# EasyEDA schematic hp_pcb_easyeda_std.json
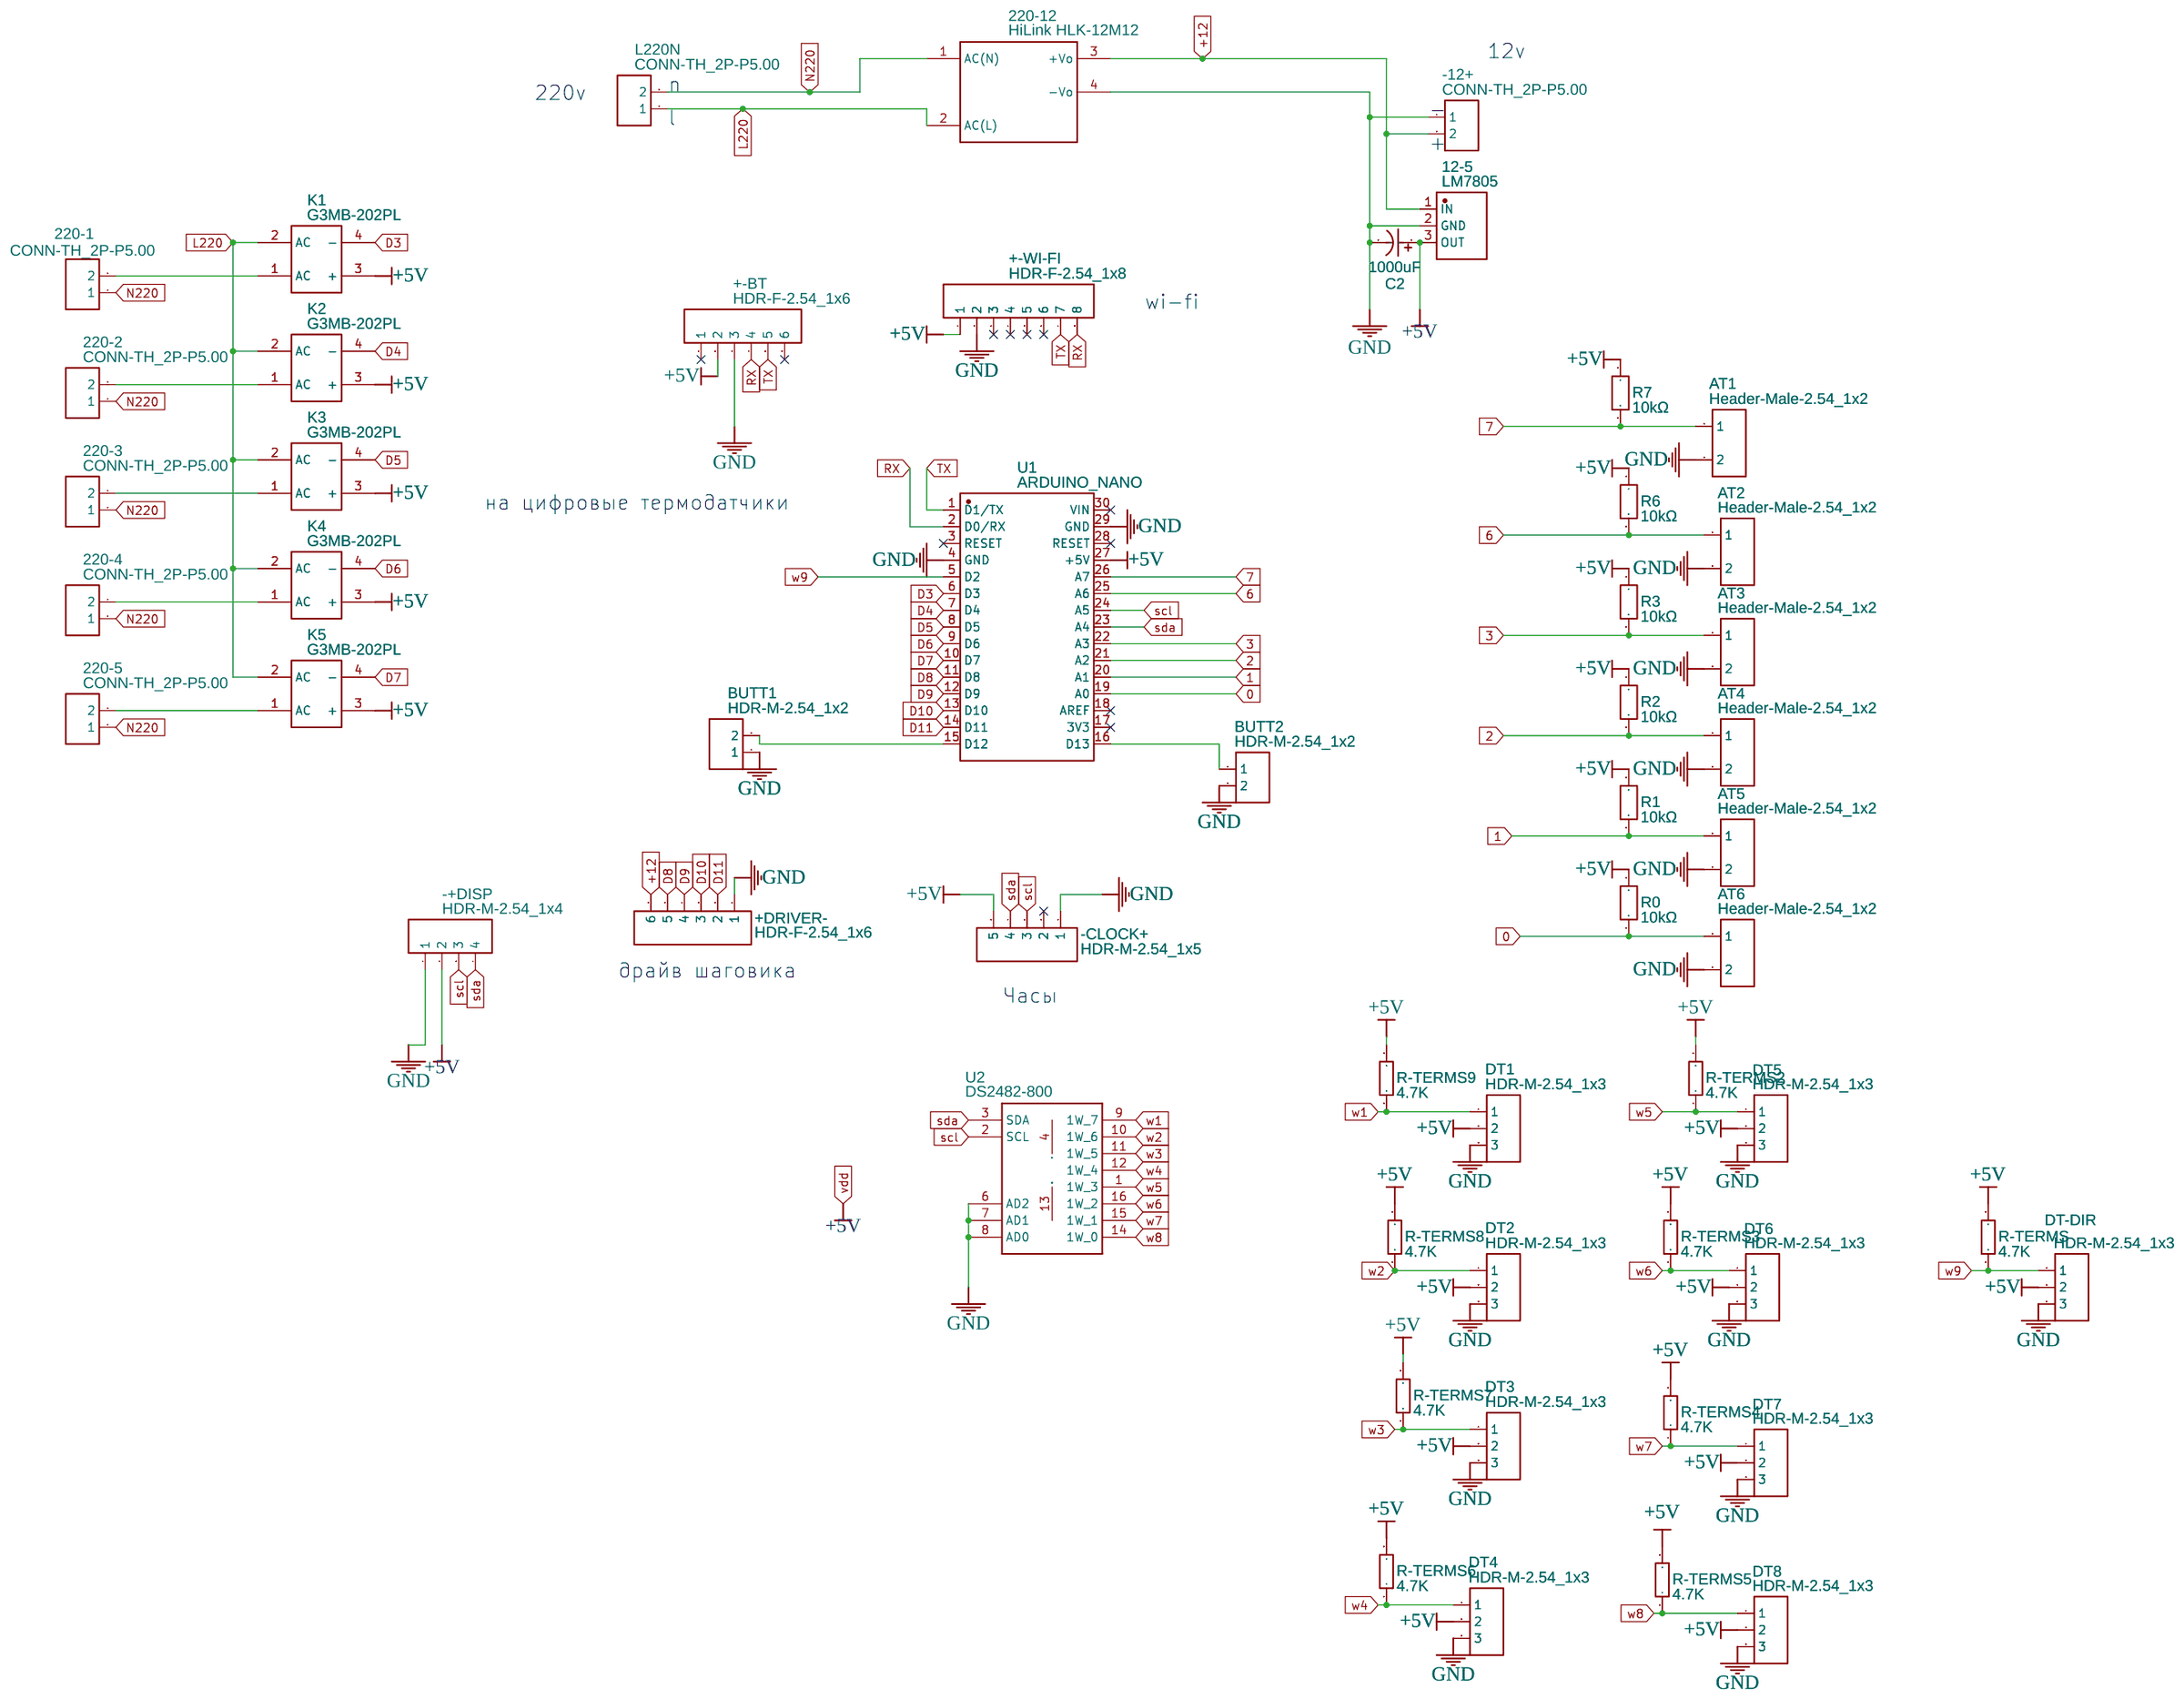
[diagram p0: schematic sheet]

## Parts
12-5  LM7805  [TO-220-3_L10.0-W4.5-P2.54-L]
220-1  CONN-TH_2P-P5.00  [CONN-TH_2P-P5.00]
220-2  CONN-TH_2P-P5.00  [CONN-TH_2P-P5.00]
220-3  CONN-TH_2P-P5.00  [CONN-TH_2P-P5.00]
220-4  CONN-TH_2P-P5.00  [CONN-TH_2P-P5.00]
220-5  CONN-TH_2P-P5.00  [CONN-TH_2P-P5.00]
220-12  HiLink HLK-12M12  [HLK-12M12]
+-BT  HDR-F-2.54_1x6  [HDR-F-2.54_1X6]
+-WI-FI  HDR-F-2.54_1x8  [HDR-F-2.54_1X8]
+DRIVER-  HDR-F-2.54_1x6  [HDR-F-2.54_1X6]
-12+  CONN-TH_2P-P5.00  [CONN-TH_2P-P5.00]
-+DISP  HDR-M-2.54_1x4  [HDR-M-2.54_1X4]
-CLOCK+  HDR-M-2.54_1x5  [HDR-M-2.54_1X5]
AT1  Header-Male-2.54_1x2  [HDR-TH_2P-P2.54-V-M-1]
AT2  Header-Male-2.54_1x2  [HDR-TH_2P-P2.54-V-M-1]
AT3  Header-Male-2.54_1x2  [HDR-TH_2P-P2.54-V-M-1]
AT4  Header-Male-2.54_1x2  [HDR-TH_2P-P2.54-V-M-1]
AT5  Header-Male-2.54_1x2  [HDR-TH_2P-P2.54-V-M-1]
AT6  Header-Male-2.54_1x2  [HDR-TH_2P-P2.54-V-M-1]
BUTT1  HDR-M-2.54_1x2  [HDR-M-2.54_1X2]
BUTT2  HDR-M-2.54_1x2  [HDR-M-2.54_1X2]
C2  1000uF  [CAP-TH_BD8.0-P3.50-D0.6-FD_1]
DT1  HDR-M-2.54_1x3  [HDR-M-2.54_1X3]
DT2  HDR-M-2.54_1x3  [HDR-M-2.54_1X3]
DT3  HDR-M-2.54_1x3  [HDR-M-2.54_1X3]
DT4  HDR-M-2.54_1x3  [HDR-M-2.54_1X3]
DT5  HDR-M-2.54_1x3  [HDR-M-2.54_1X3]
DT6  HDR-M-2.54_1x3  [HDR-M-2.54_1X3]
DT7  HDR-M-2.54_1x3  [HDR-M-2.54_1X3]
DT8  HDR-M-2.54_1x3  [HDR-M-2.54_1X3]
DT-DIR  HDR-M-2.54_1x3  [HDR-M-2.54_1X3]
K1  G3MB-202PL  [RELAY-TH_G3MB-202PL]
K2  G3MB-202PL  [RELAY-TH_G3MB-202PL]
K3  G3MB-202PL  [RELAY-TH_G3MB-202PL]
K4  G3MB-202PL  [RELAY-TH_G3MB-202PL]
K5  G3MB-202PL  [RELAY-TH_G3MB-202PL]
L220N  CONN-TH_2P-P5.00  [CONN-TH_2P-P5.00]
R0  10kΩ  [RES-TH_BD1.8-L3.2-P7.20-D0.4]
R1  10kΩ  [RES-TH_BD1.8-L3.2-P7.20-D0.4]
R2  10kΩ  [RES-TH_BD1.8-L3.2-P7.20-D0.4]
R3  10kΩ  [RES-TH_BD1.8-L3.2-P7.20-D0.4]
R6  10kΩ  [RES-TH_BD1.8-L3.2-P7.20-D0.4]
R7  10kΩ  [RES-TH_BD1.8-L3.2-P7.20-D0.4]
R-TERMS  4.7K  [RES-TH_BD2.3-L6.5-P10.50-D0.5]
R-TERMS2  4.7K  [RES-TH_BD2.3-L6.5-P10.50-D0.5]
R-TERMS3  4.7K  [RES-TH_BD2.3-L6.5-P10.50-D0.5]
R-TERMS4  4.7K  [RES-TH_BD2.3-L6.5-P10.50-D0.5]
R-TERMS5  4.7K  [RES-TH_BD2.3-L6.5-P10.50-D0.5]
R-TERMS6  4.7K  [RES-TH_BD2.3-L6.5-P10.50-D0.5]
R-TERMS7  4.7K  [RES-TH_BD2.3-L6.5-P10.50-D0.5]
R-TERMS8  4.7K  [RES-TH_BD2.3-L6.5-P10.50-D0.5]
R-TERMS9  4.7K  [RES-TH_BD2.3-L6.5-P10.50-D0.5]
U1  ARDUINO_NANO  [COMM-TH_ARDUINO_NANO]
U2  DS2482-800  [S016]

## Library data of the parts
12-5 = LM7805: Supplier: LCSC; Supplier Part: C845394; Manufacturer: TF; Contributor: LCSC; JLCPCB Part Class: Extended Part
220-1-220-5 -12+ L220N = CONN-TH_2P-P5.00: Supplier: LCSC; Contributor: LCEDA_Lib
220-12 = HiLink HLK-12M12: Manufacturer: HiLink; Contributor: danieljmkenyon
+-BT +DRIVER- = HDR-F-2.54_1x6: Supplier Part: C40877; Supplier: LCSC; Contributor: LCEDA_Lib
+-WI-FI = HDR-F-2.54_1x8: Supplier Part: C225505; Supplier: LCSC; Contributor: LCEDA_Lib
-+DISP = HDR-M-2.54_1x4: Supplier Part: C124378; Supplier: LCSC; Contributor: LCEDA_Lib
-CLOCK+ = HDR-M-2.54_1x5: Supplier Part: C358687; Supplier: LCSC; Contributor: LCEDA_Lib
AT1-AT6 = Header-Male-2.54_1x2: Supplier: LCSC; Manufacturer: TE Connectivity(美国泰科); Manufacturer Part: 826629-2; Supplier Part: C86471; JLCPCB Part Class: Extended Part
BUTT1 BUTT2 = HDR-M-2.54_1x2: Supplier Part: C124375; Supplier: LCSC; Contributor: LCEDA_Lib
C2 = 1000uF 10V 8*14: Supplier: LCSC; Manufacturer: ValuePro; Manufacturer Part: 1000uF 10V绿金 8*14; Supplier Part: C43337; JLCPCB Part Class: Extended Part
DT1-DT8 DT-DIR = HDR-M-2.54_1x3: Supplier Part: C180248; Supplier: LCSC; Contributor: LCEDA_Lib
K1-K5 = G3MB-202PL: Supplier: LCSC; Manufacturer: OMRON(欧姆龙); Supplier Part: C48654; JLCPCB Part Class: Extended Part
R0-R3 R6 R7 = MF1/8W-10KΩ±1%T52: Supplier: LCSC; Supplier Part: C713919; Manufacturer: 华星机电; Contributor: LCSC; JLCPCB Part Class: Extended Part
R-TERMS R-TERMS2-R-TERMS9 = CF1/4W-4.7KΩ±5% T52: Supplier: LCSC; Supplier Part: C120071; Manufacturer: Chian Chia Elec; Contributor: LCSC; JLCPCB Part Class: Extended Part; Resistance: 4.7kΩ
U1 = ARDUINO_NANO: Supplier: LCSC; Supplier Part: C9900017879; Manufacturer: null; JLCPCB Part Class: Extended Part; Contributor: lcsc
U2 = DS2482-800

## Nets
+5V: 12-5.3(OUT) +-BT.2 +-WI-FI.1 -+DISP.2 -CLOCK+.5 C2.1 DT1.2 DT2.2 DT3.2 DT4.2 DT5.2 DT6.2 DT7.2 DT8.2 DT-DIR.2 K1.3(+) K2.3(+) K3.3(+) K4.3(+) K5.3(+) R0.1 R1.1 R2.1 R3.1 R6.1 R7.1 R-TERMS.2 R-TERMS2.2 R-TERMS3.2 R-TERMS4.2 R-TERMS5.2 R-TERMS6.2 R-TERMS7.2 R-TERMS8.2 R-TERMS9.2 U1.27(+5V)
GND: 12-5.2(GND) 220-12.4(-Vo) +-BT.3 +-WI-FI.2 +DRIVER-.1 -12+.1 -+DISP.1 -CLOCK+.1 AT1.2 AT2.2 AT3.2 AT4.2 AT5.2 AT6.2 BUTT1.1 BUTT2.2 C2.2 DT1.3 DT2.3 DT3.3 DT4.3 DT5.3 DT6.3 DT7.3 DT8.3 DT-DIR.3 U1.4(GND) U1.29(GND) U2.6(AD2) U2.7(AD1) U2.8(AD0)
0: AT6.1 R0.2 U1.19(A0)
1: AT5.1 R1.2 U1.20(A1)
2: AT4.1 R2.2 U1.21(A2)
3: AT3.1 R3.2 U1.22(A3)
6: AT2.1 R6.2 U1.25(A6)
7: AT1.1 R7.2 U1.26(A7)
+12: 12-5.1(IN) 220-12.3(+Vo) +DRIVER-.6 -12+.2
D3: K1.4(-) U1.6(D3)
D4: K2.4(-) U1.7(D4)
D5: K3.4(-) U1.8(D5)
D6: K4.4(-) U1.9(D6)
D7: K5.4(-) U1.10(D7)
D8: +DRIVER-.5 U1.11(D8)
D9: +DRIVER-.4 U1.12(D9)
D10: +DRIVER-.3 U1.13(D10)
D11: +DRIVER-.2 U1.14(D11)
L220: 220-12.2(AC(L)) K1.2(AC) K2.2(AC) K3.2(AC) K4.2(AC) K5.2(AC) L220N.1
N220: 220-1.1 220-2.1 220-3.1 220-4.1 220-5.1 220-12.1(AC(N)) L220N.2
RX: +-BT.4 +-WI-FI.8 U1.2(D0/RX)
scl: -+DISP.3 -CLOCK+.3 U1.24(A5) U2.2(SCL)
sda: -+DISP.4 -CLOCK+.4 U1.23(A4) U2.3(SDA)
TX: +-BT.5 +-WI-FI.7 U1.1(D1/TX)
w1: DT1.1 R-TERMS9.1 U2.9(1W_7)
w2: DT2.1 R-TERMS8.1 U2.10(1W_6)
w3: DT3.1 R-TERMS7.1 U2.11(1W_5)
w4: DT4.1 R-TERMS6.1 U2.12(1W_4)
w5: DT5.1 R-TERMS2.1 U2.1(1W_3)
w6: DT6.1 R-TERMS3.1 U2.16(1W_2)
w7: DT7.1 R-TERMS4.1 U2.15(1W_1)
w8: DT8.1 R-TERMS5.1 U2.14(1W_0)
w9: DT-DIR.1 R-TERMS.1 U1.5(D2)
Net-(220-1-2): 220-1.2 K1.1(AC)
Net-(220-2-2): 220-2.2 K2.1(AC)
Net-(220-3-2): 220-3.2 K3.1(AC)
Net-(220-4-2): 220-4.2 K4.1(AC)
Net-(220-5-2): 220-5.2 K5.1(AC)
Net-(BUTT1-2): BUTT1.2 U1.15(D12)
Net-(BUTT2-1): BUTT2.1 U1.16(D13)

Not connected (* = marked no-connect by the designer): +-BT 1* 6*; +-WI-FI 3* 4* 5* 6*; -CLOCK+ 2*; U1 3(RESET)* 17(3V3)* 18(AREF)* 28(RESET)* 30(VIN)*; U2 4(VDD) 13(GND)

## Notes on the sheet
- 12v
- 220v
- n
- -
- l
- +
- wi-fi
- на цифровые термодатчики
- драйв шаговика
- Часы
